# EAGLE design datalogger (EAGLE 9.2.2)
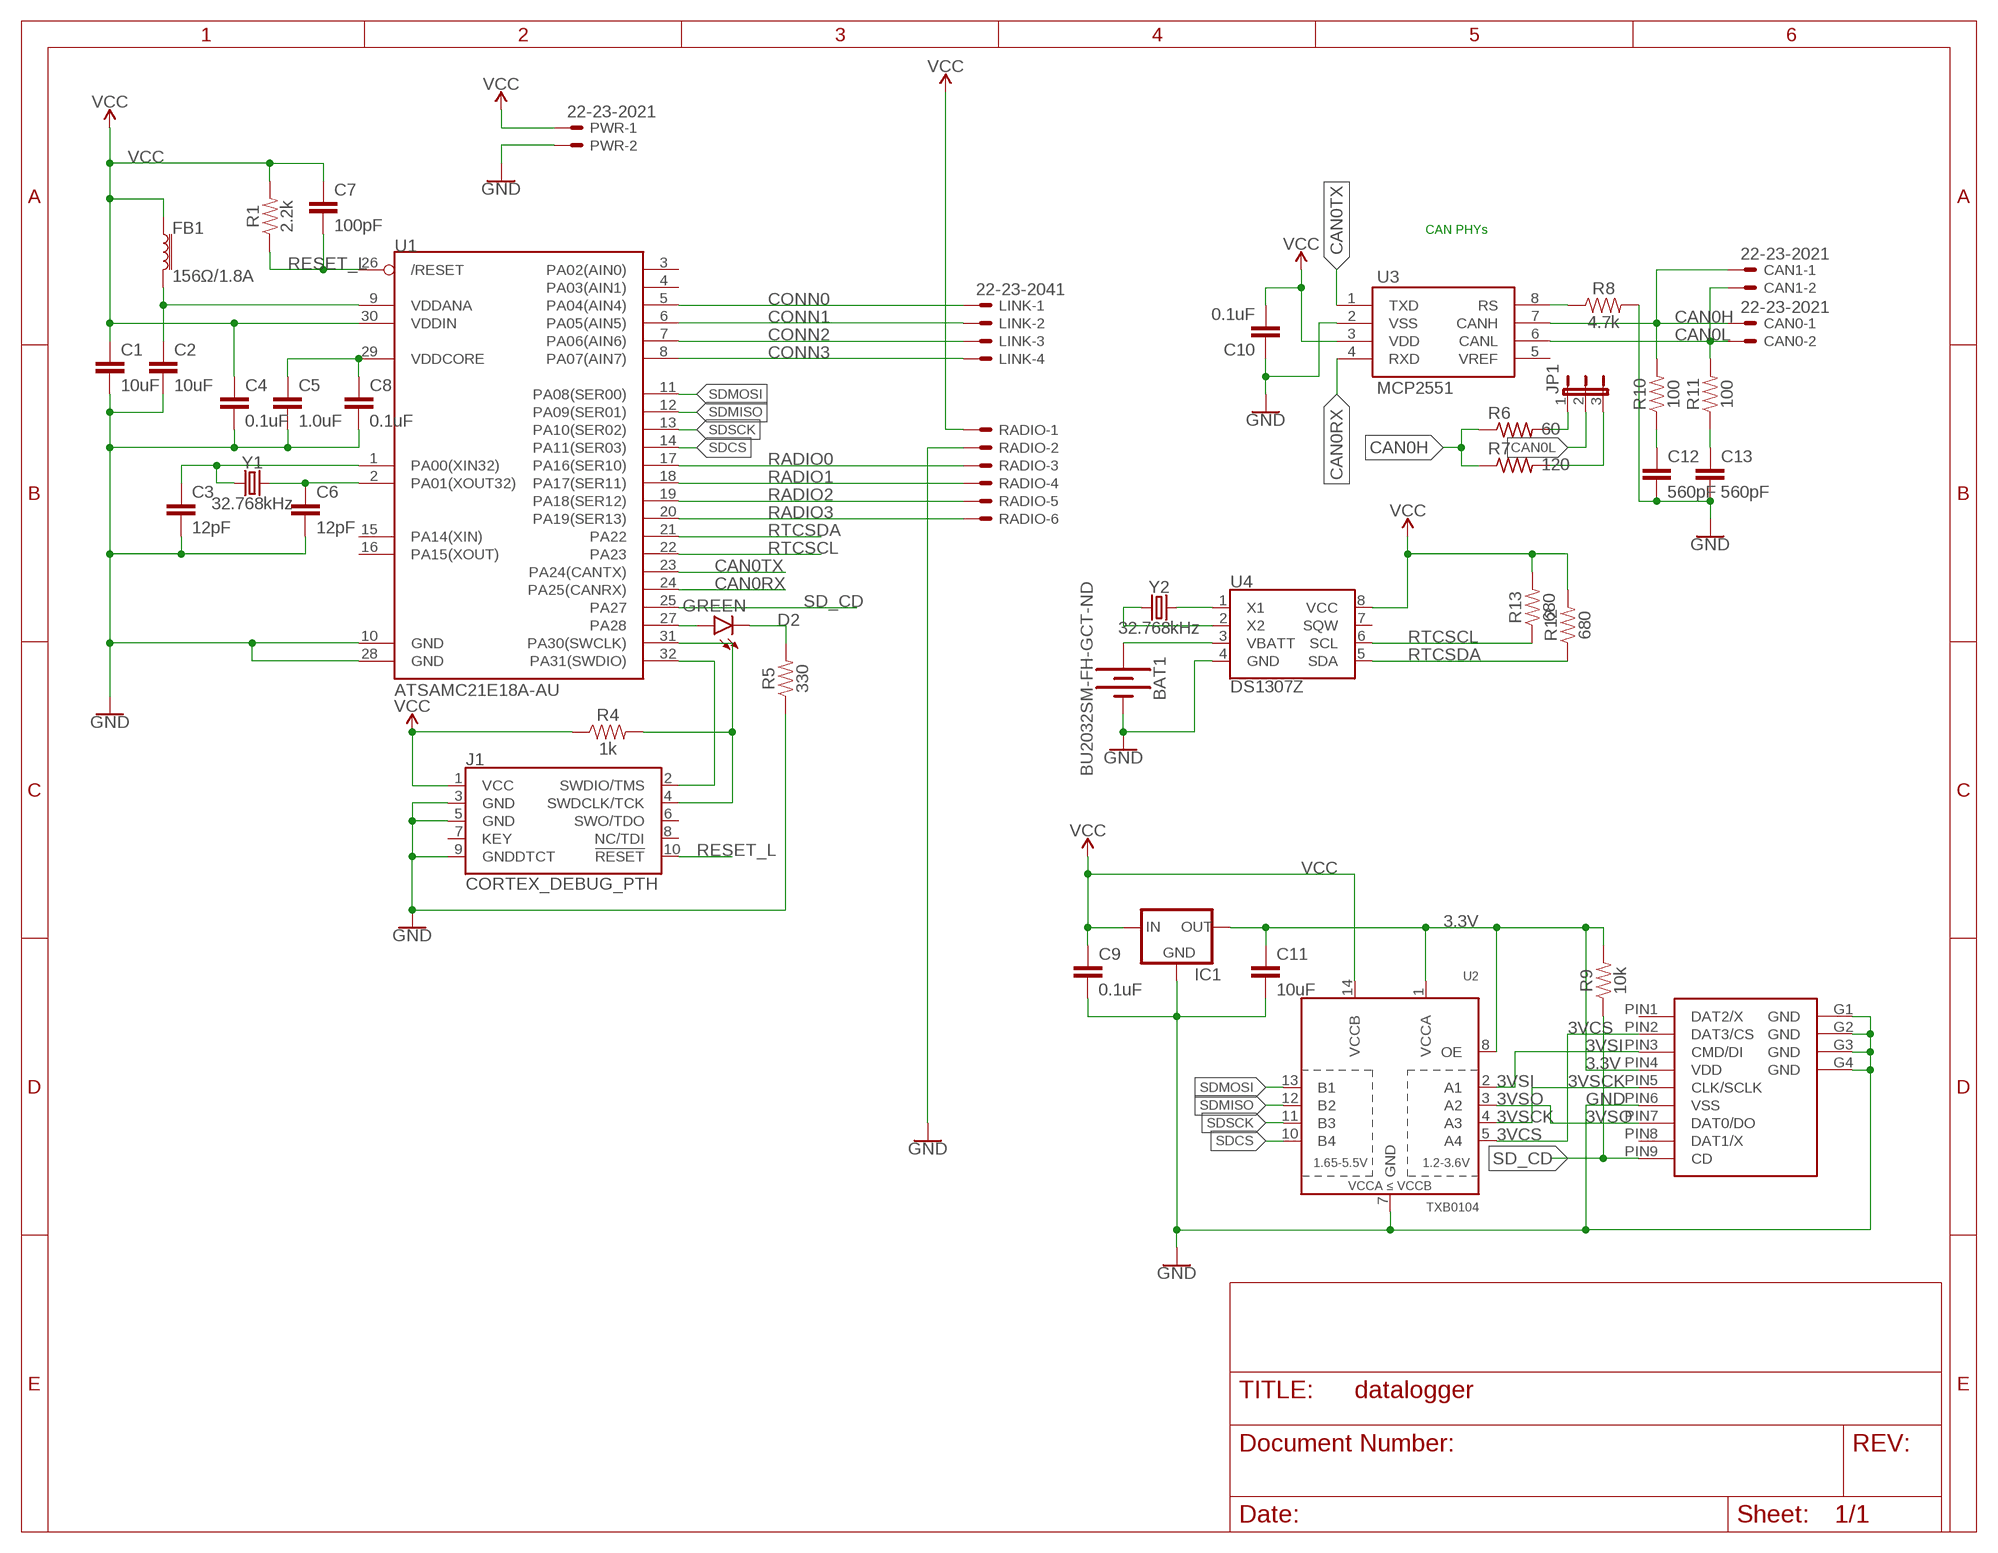
[diagram p0: schematic, sheet 1]

## Parts
BAT1  BU2032SM-FH-GCT-ND  [BAT_BU2032SM-BT-GTR]
C1  10uF  10UF-0603-6.3V-20%  [0603]
C2  10uF  10UF-0603-6.3V-20%  [0603]
C3  12pF  12PF-0603-50V-5%  [0603]
C4  0.1uF  0.1UF-0603-25V-(+80/-20%)  [0603]
C5  1.0uF  1.0UF-0603-16V-10%  [0603]
C6  12pF  12PF-0603-50V-5%  [0603]
C7  100pF  100PF-0603-50V-5%  [0603]
C8  0.1uF  0.1UF-0603-25V-(+80/-20%)  [0603]
C9  0.1uF  0.1UF-0603-25V-(+80/-20%)  [0603]
C10  0.1uF  0.1UF-0603-25V-(+80/-20%)  [0603]
C11  10uF  10UF-0603-6.3V-20%  [0603]
C12  560pF  560PF-0603-50V-5%  [0603]
C13  560pF  560PF-0603-50V-5%  [0603]
CAN0  22-23-2021  [22-23-2021]
CAN1  22-23-2021  [22-23-2021]
D2  GREEN  LED3MM  [LED_3MM]
FB1  156Ω/1.8A  FERRITE_BEAD-0603  [0603]
IC1  78LXX  [78LXX]
J1  CORTEX_DEBUG_PTH  [2X5-PTH-1.27MM]
JP1  JP2E  [JP2]
LINK  22-23-2041  [22-23-2041]
PWR  22-23-2021  [22-23-2021]
R1  2.2k  2.2KOHM-0603-1/10W-1%  [0603]
R4  1k  1KOHM-0603-1/10W-1%  [0603]
R5  330  330OHM-0603-1/10W-1%  [0603]
R6  60  R-US_R0603  [R0603]
R7  120  R-US_R0603  [R0603]
R8  4.7k  4.7KOHM-0603-1/10W-1%  [0603]
R9  10k  10KOHM-0603-1/10W-1%  [0603]
R10  100  100OHM-0603-1/4W-5%  [0603]
R11  100  100OHM-0603-1/4W-5%  [0603]
R12  680  680OHM-0603-1/10W-5%  [0603]
R13  680  680OHM-0603-1/10W-5%  [0603]
RADIO  22-23-2061  [22-23-2061]
SD1  WM14405CT-ND  [1051620001-SMD]
U1  ATSAMC21E18A-AU  [TQFP32-08]
U2  TXB0104  TXB0104PWR  [TSSOP14]
U3  MCP2551  [SO08]
U4  DS1307Z  [SO08-0.15]
Y1  32.768kHz  CRYSTAL-32.768KHZPTH-2X6  [CRYSTAL-PTH-2X6-CYL]
Y2  32.768kHz  CRYSTAL-32.768KHZPTH-2X6  [CRYSTAL-PTH-2X6-CYL]

## Nets
3.3V: C11.1 IC1.OUT R9.2 SD1.PIN4(VDD) U2.1(VCCA) U2.8(OE)
3VCS: SD1.PIN2(DAT3/CS) U2.5(A4)
3VSCK: SD1.PIN5(CLK/SCLK) U2.4(A3)
3VSI: SD1.PIN3(CMD/DI) U2.2(A1)
3VSO: SD1.PIN7(DAT0/DO) U2.3(A2)
C1HRC: C12.1 R10.1
C1LRC: C13.1 R11.1
C1RS: R8.1 U3.8(RS)
CAN0H: CAN0.1 CAN1.1 R6.1 R7.1 R10.2 U3.7(CANH)
CAN0L: CAN0.2 CAN1.2 JP1.2 R11.2 U3.6(CANL)
CAN0RX: U1.24(PA25(CANRX)) U3.4(RXD)
CAN0TX: U1.23(PA24(CANTX)) U3.1(TXD)
CONN0: LINK.1 U1.5(PA04(AIN4))
CONN1: LINK.2 U1.6(PA05(AIN5))
CONN2: LINK.3 U1.7(PA06(AIN6))
CONN3: LINK.4 U1.8(PA07(AIN7))
GND [power]: BAT1.2(-) C1.2 C2.2 C3.2 C4.2 C5.2 C6.2 C8.2 C9.2 C10.1 C11.2 C12.2 C13.2 IC1.GND J1.3(GND) J1.5(GND) J1.9(GNDDTCT) PWR.2 R5.1 R8.2 RADIO.2 SD1.G1(GND) SD1.G2(GND) SD1.G3(GND) SD1.G4(GND) SD1.PIN6(VSS) U1.10(GND) U1.28(GND) U2.7(GND) U3.2(VSS) U4.4(GND)
LEDA: D2.A U1.27(PA28)
LEDC: D2.K(C) R5.2
N$1: BAT1.1(+) U4.3(VBATT)
N$4: U4.1(X1) Y2.2
N$5: JP1.1 R6.2
N$6: U4.2(X2) Y2.1
N$7: JP1.3 R7.2
RADIO0: RADIO.3 U1.17(PA16(SER10))
RADIO1: RADIO.4 U1.18(PA17(SER11))
RADIO2: RADIO.5 U1.19(PA18(SER12))
RADIO3: RADIO.6 U1.20(PA19(SER13))
RESET_L: C7.2 J1.10(!RESET) R1.1 U1.26(/RESET)
RTCSCL: R13.1 U1.22(PA23) U4.6(SCL)
RTCSDA: R12.1 U1.21(PA22) U4.5(SDA)
SD_CD: R9.1 SD1.PIN9(CD) U1.25(PA27)
SDCS: U1.14(PA11(SER03)) U2.10(B4)
SDMISO: U1.12(PA09(SER01)) U2.12(B2)
SDMOSI: U1.11(PA08(SER00)) U2.13(B1)
SDSCK: U1.13(PA10(SER02)) U2.11(B3)
SWDCLK: J1.4(SWDCLK/TCK) R4.2 U1.31(PA30(SWCLK))
SWDIO: J1.2(SWDIO/TMS) U1.32(PA31(SWDIO))
VCC [power]: C1.1 C4.1 C7.1 C9.1 C10.2 FB1.1 IC1.IN J1.1(VCC) PWR.1 R1.2 R4.1 R12.2 R13.2 RADIO.1 U1.30(VDDIN) U2.14(VCCB) U3.3(VDD) U4.8(VCC)
VDDANA1: C2.1 FB1.2 U1.9(VDDANA)
VDDCORE: C5.1 C8.1 U1.29(VDDCORE)
XIN32: C3.1 U1.1(PA00(XIN32)) Y1.1
XOUT32: C6.1 U1.2(PA01(XOUT32)) Y1.2
Unconnected: J1.6(SWO/TDO) J1.7(KEY) J1.8(NC/TDI) SD1.PIN1(DAT2/X) SD1.PIN8(DAT1/X) U1.3(PA02(AIN0)) U1.4(PA03(AIN1)) U1.15(PA14(XIN)) U1.16(PA15(XOUT)) U3.5(VREF) U4.7(SQW)

## Notes on the sheet
- CAN PHYs

## Library data of the parts
BAT1 = washuracing:BU2032SM-FH-GCT-ND: CR2032 SM COIN CELL HOLDER
C1 C2 C11 = SparkFun-Capacitors:10UF: 10.0µF ceramic capacitors A capacitor is a passive two-terminal electrical component used to store electrical energy temporarily in an electric field.; PROD_ID: CAP-11015
C3 C6 = SparkFun-Capacitors:12PF: 12pF ceramic capacitors A capacitor is a passive two-terminal electrical component used to store electrical energy temporarily in an electric field.; PROD_ID: CAP-09137
C4 C8-C10 = SparkFun-Capacitors:0.1UF: 0.1µF ceramic capacitors A capacitor is a passive two-terminal electrical component used to store electrical energy temporarily in an electric field.; PROD_ID: CAP-00810
C5 = SparkFun-Capacitors:1.0UF: 1µF ceramic capacitors A capacitor is a passive two-terminal electrical component used to store electrical energy temporarily in an electric field.; PROD_ID: CAP-00868
C7 = SparkFun-Capacitors:100PF: 100pF/0.1nF ceramic capacitors A capacitor is a passive two-terminal electrical component used to store electrical energy temporarily in an electric field.; PROD_ID: CAP-07883
C12 C13 = SparkFun-Capacitors:560PF: 0.56nF/560pF ceramic capacitors A capacitor is a passive two-terminal electrical component used to store electrical energy temporarily in an electric field.; PROD_ID: CAP-08749
CAN0 CAN1 PWR = con-molex:22-23-2021: .100" (2.54mm) Center Header - 2 Pin; MF: MOLEX; MPN: 22-23-2021; OC_FARNELL: 1462926; OC_NEWARK: 25C3832
D2 = SparkFun-LED:LED: LED (Generic) Standard schematic elements and footprints for 5mm, 3mm, 1206, and 0603 sized LEDs. Generic LEDs with no color specified.; PROD_ID: DIO-08794
FB1 = SparkFun-Coils:FERRITE_BEAD: Ferrite Bead (blocks, cores, rings, chokes, etc.) Inductor with layers of ferrite used to suppress high frequencies. Often used to isolate high frequency noise. SparkFun Products: IOIO-OTG - V2.2 <https://www.sparkfun.com/products/13613> SparkFun SAMD21 Mini Breakout <https://www.sparkfun.com/products/13664> SparkFun 6 Degrees of Freedom Breakout - LSM6DS3 <https://www.sparkfun.com/products/13339> SparkFun SAMD21 Dev Breakout <https://www.sparkfun.com/products/13672>; PROD_ID: NDUC-07859; VALUE: 30Ω/1.8A
IC1 = v-reg:78LXX: VOLTAGE REGULATOR
J1 = SparkFun-Connectors:CORTEX_DEBUG: Cortex Debug Connector - 10 pin Supports JTAG debug, Serial Wire debug, and Serial Wire Viewer. PTH and SMD connector options available. General Connector Information <http://infocenter.arm.com/help/topic/com.arm.doc.faqs/attached/13634/cortex_debug_connectors.pdf> Products: PTH Connector <http://www.digikey.com/product-detail/en/cnc-tech/3220-10-0100-00/1175-1627-ND/3883661> -via Digi-Key SparkFun PSoc <https://www.sparkfun.com/products/13229> SparkFun T <https://www.sparkfun.com/products/13810>
JP1 = jumper:JP2E: JUMPER
LINK = con-molex:22-23-2041: .100" (2.54mm) Center Header - 4 Pin; MF: MOLEX; MPN: 22-23-2041; OC_FARNELL: 1462920; OC_NEWARK: 38C0355
R1 = SparkFun-Resistors:2.2KOHM: 2.2kΩ resistor A resistor is a passive two-terminal electrical component that implements electrical resistance as a circuit element. Resistors act to reduce current flow, and, at the same time, act to lower voltage levels within circuits. - Wikipedia; PROD_ID: RES-08272
R4 = SparkFun-Resistors:1KOHM: 1kΩ resistor A resistor is a passive two-terminal electrical component that implements electrical resistance as a circuit element. Resistors act to reduce current flow, and, at the same time, act to lower voltage levels within circuits. - Wikipedia; PROD_ID: RES-07856
R5 = SparkFun-Resistors:330OHM: 330Ω resistor A resistor is a passive two-terminal electrical component that implements electrical resistance as a circuit element. Resistors act to reduce current flow, and, at the same time, act to lower voltage levels within circuits. - Wikipedia; PROD_ID: RES-00818
R6 R7 = rcl:R-US_: RESISTOR, American symbol; SPICEPREFIX: R
R8 = SparkFun-Resistors:4.7KOHM: 4.7kΩ resistor A resistor is a passive two-terminal electrical component that implements electrical resistance as a circuit element. Resistors act to reduce current flow, and, at the same time, act to lower voltage levels within circuits. - Wikipedia; PROD_ID: RES-07857
R9 = SparkFun-Resistors:10KOHM: 10kΩ resistor A resistor is a passive two-terminal electrical component that implements electrical resistance as a circuit element. Resistors act to reduce current flow, and, at the same time, act to lower voltage levels within circuits. - Wikipedia; PROD_ID: RES-00824
R10 R11 = SparkFun-Resistors:100OHM: 100Ω resistor A resistor is a passive two-terminal electrical component that implements electrical resistance as a circuit element. Resistors act to reduce current flow, and, at the same time, act to lower voltage levels within circuits. - Wikipedia; PROD_ID: RES-12438
R12 R13 = SparkFun-Resistors:680OHM: 680Ω resistor A resistor is a passive two-terminal electrical component that implements electrical resistance as a circuit element. Resistors act to reduce current flow, and, at the same time, act to lower voltage levels within circuits. - Wikipedia; PROD_ID: RES-09333
RADIO = con-molex:22-23-2061: .100" (2.54mm) Center Header - 6 Pin; MF: MOLEX; MPN: 22-23-2061; OC_FARNELL: 1462922; OC_NEWARK: 27C1933
SD1 = washuracing:WM14405CT-ND: 1.45H MICRO SD HEADER WITH D/C P 9 (8 + 1) Position Card Connector microSD™ Surface Mount, Right Angle Gold
U1 = washuracing:ATSAMC21E18A: 5-Volt 32-Bit ARM Cortex M0+ MCU with CAN-FD
U2 = SparkFun-IC-Comms:TXB0104PWR: 4-Bit Bi-Directional Level Shifter 1.2V-3.6V (VCCA) to 1.65V-5.5V (VCCB) bi-directional level shifter with auto direction sensing. Max data rate - VCCA 1.8V: 20Mbps (50ns), VCCA 3.3V: 100Mbps (10ns) Digikey: 296-21929-1-ND (TSSOP) Datasheet <http://cdn.sparkfun.com/datasheets/BreakoutBoards/txb0104.pdf> SparkFun Products SparkFun Cellular Shield - MG2639 <https://www.sparkfun.com/products/13120> (CEL-13120) SparkFun Level Shifting microSD Breakout <https://www.sparkfun.com/products/13743> (DEV-13743) SparkFun Voltage-Level Translator Breakout - TXB0104 <https://www.sparkfun.com/products/11771> (BOB-11771) SparkFun Block for Intel® Edison - UART <https://www.sparkfun.com/products/13040> (DEV-13040) SparkFun Block for Intel® Edison - Arduino <https://www.sparkfun.com/products/13036> (DEV-13036); PROD_ID: NA-XXXXX
U3 = SparkFun-IC-Comms:MCP2551: MCP2551 High Speed CAN Transceiver High speed CAN transceiver Datasheet <http://www.sparkfun.com/datasheets/DevTools/Arduino/MCP2551.pdf> SparkFun Products CAN-BUS Shield <https://www.sparkfun.com/products/13262> (DEV-13262) SparkFun OBD-II UART <https://www.sparkfun.com/products/9555> (WIG-09555); PROD_ID: IC-09907
U4 = SparkFun-Clocks:DS1307: Maxim DS1307 - I2C Real-time clock (RTC) The DS1307 serial real-time clock (RTC) is a low-power, full binary-coded decimal (BCD) clock/calendar plus 56 bytes of NV SRAM. Address and data are transferred serially through an I2C, bidirectional bus. The clock/calendar provides seconds, minutes, hours, day, date, month, and year information. SparkFun Products: Real Time Clock Module <https://www.sparkfun.com/products/12708> (BOB-12708) Datasheet <https://cdn.sparkfun.com/datasheets/BreakoutBoards/DS1307.pdf>; PROD_ID: IC-08138
Y1 Y2 = SparkFun-Clocks:CRYSTAL-32.768KHZ: 32.768kHz Crystal Frequency: 32.768kHz Frequency Stability: ±20ppm Load Capacitance: 12.5pF (PTH-2X6 & SMD-3.2X1.5), 6pF (SMD-2X6) SparkFun Products: SparkFun BigTime Watch Kit <https://www.sparkfun.com/products/11734> SparkFun nRF52832 Breakout <https://www.sparkfun.com/products/13990> SparkFun Real Time Clock Module <https://www.sparkfun.com/products/12708>; PROD_ID: XTAL-10112

## Net classes
0 default: width 0.203 mm
1 power: width 0.406 mm

## Board
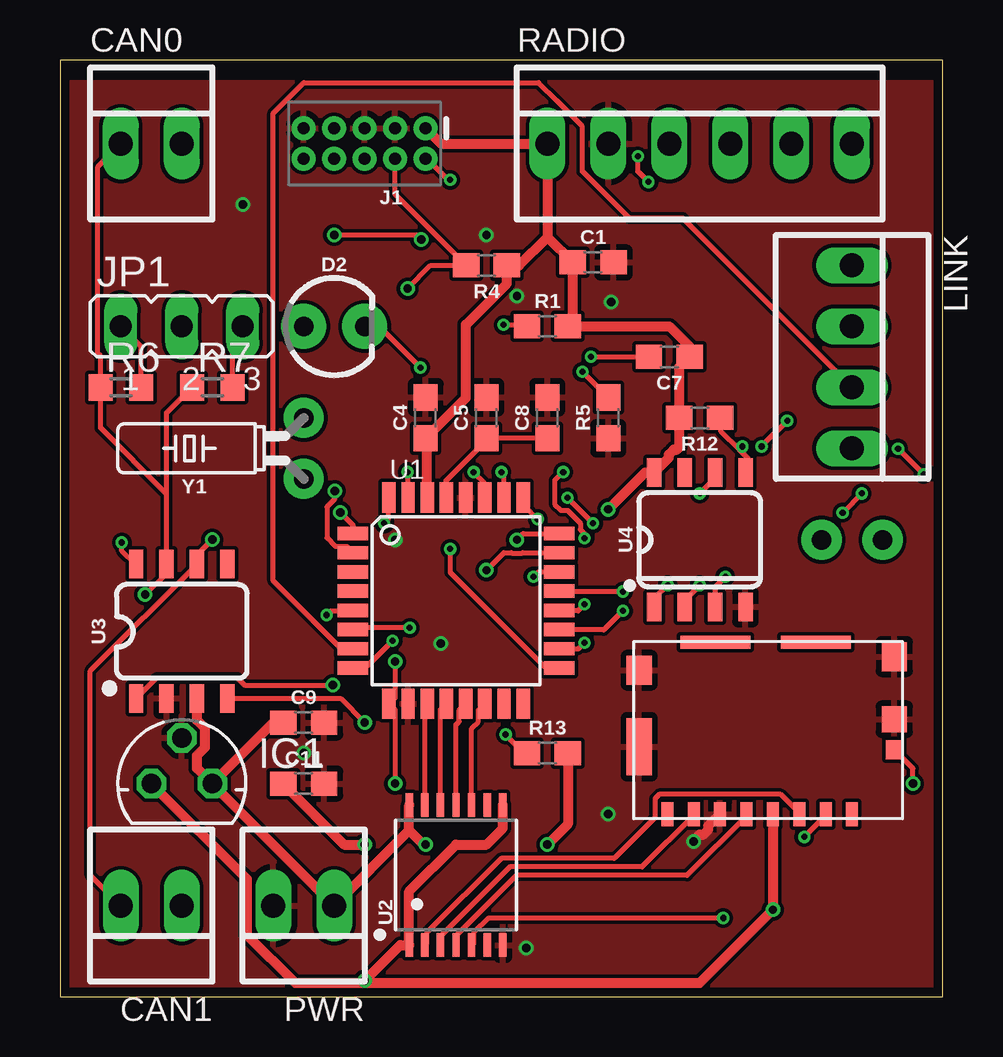
[diagram p1: board, top side]
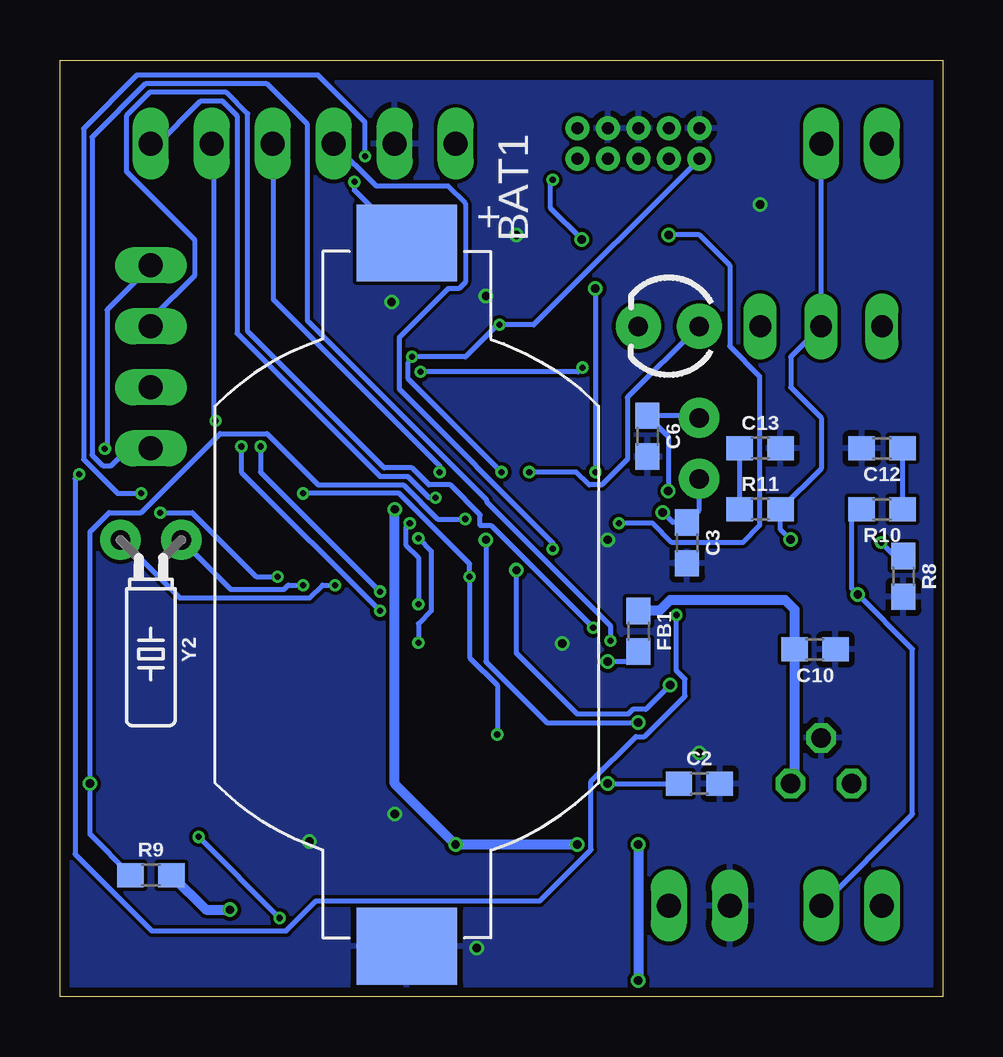
[diagram p2: board, bottom side, seen from below]

Size 36.81 x 39.04 mm. Coordinates in mm from the lower left corner, seen from the top.
Outline: 0,0 36.81,0 36.81,39.04 0,39.04 0,0
Copper layers (1*16): Top 0.035559375mm / dielectric 1.6mm / Bottom 0.035559375mm
Design rules "oshpark-2layer": minimum track width 6mil, minimum drill 10mil, track to track 6mil, track to pad 6mil, pad to pad 6mil, via to via 6mil, smd to smd 6mil, copper to edge 15mil, drill to drill 6mil, minimum pad ring 5mil, minimum via ring 5mil, stop-mask expansion 2.5mil, vias tented up to drill 0mil, thermal gap 10mil

### Footprints (pad centres in the part's own frame; a part is rotated, then mirrored left to right if it is on the bottom)
BAT_BU2032SM-BT-GTR = smd 3.2 x 4.2: 1 -14.65,0; 2 14.65,0
0603 = smd 1.1 x 1: 1 -0.85,0; 2 0.85,0
22-23-2021 = drill 1 long: 1 -1.27,0; 2 1.27,0
LED_3MM = drill 0.813 pad 1.88: A -1.27,0; K 1.27,0
78LXX = drill 0.813 octagon: GND 0,1.905; IN 1.27,0; OUT -1.27,0
2X5-PTH-1.27MM = drill 0.508 pad 1: 1 -2.54,-0.635; 2 -2.54,0.635; 3 -1.27,-0.635; 4 -1.27,0.635; 5 0,-0.635; 6 0,0.635; 7 1.27,-0.635; 8 1.27,0.635; 9 2.54,-0.635; 10 2.54,0.635
JP2 = drill 0.914 long: 1 -2.54,0; 2 0,0; 3 2.54,0
22-23-2041 = drill 1 long: 1 -3.81,0; 2 -1.27,0; 3 1.27,0; 4 3.81,0
R0603 = smd 1 x 1.1: 1 -0.85,0; 2 0.85,0
22-23-2061 = drill 1 long: 1 -6.35,0; 2 -3.81,0; 3 -1.27,0; 4 1.27,0; 5 3.81,0; 6 6.35,0
1051620001-SMD = smd 1.05 x 1.08: G1 1.76,3.95 | smd 1.05 x 1.2: G2 1.76,6.56; G3 -8.875,5.99 | smd 1.05 x 2.39: G4 -8.875,2.805 | smd 0.5 x 1: PIN1 0,0; PIN2 -1.1,0; PIN3 -2.2,0; PIN4 -3.3,0; PIN5 -4.4,0; PIN6 -5.5,0; PIN7 -6.6,0; PIN8 -7.7,0 | smd 0.72 x 0.78: PIN9 1.76,2.68 | smd 2.91 x 0.55: TL -5.695,7.16; TR -1.505,7.16
TQFP32-08 = smd 1.27 x 0.559: 1 -4.293,2.8; 2 -4.293,2; 3 -4.293,1.2; 4 -4.293,0.4; 5 -4.293,-0.4; 6 -4.293,-1.2; 7 -4.293,-2; 8 -4.293,-2.8; 17 4.293,-2.8; 18 4.293,-2; 19 4.293,-1.2; 20 4.293,-0.4; 21 4.293,0.4; 22 4.293,1.2; 23 4.293,2; 24 4.293,2.8 | smd 0.559 x 1.27: 9 -2.8,-4.293; 10 -2,-4.293; 11 -1.2,-4.293; 12 -0.4,-4.293; 13 0.4,-4.293; 14 1.2,-4.293; 15 2,-4.293; 16 2.8,-4.293; 25 2.8,4.293; 26 2,4.293; 27 1.2,4.293; 28 0.4,4.293; 29 -0.4,4.293; 30 -1.2,4.293; 31 -2,4.293; 32 -2.8,4.293
TSSOP14 = smd 0.305 x 0.991: 1 -1.95,-2.918; 2 -1.3,-2.918; 3 -0.65,-2.918; 4 0,-2.918; 5 0.65,-2.918; 6 1.3,-2.918; 7 1.95,-2.918; 8 1.95,2.918; 9 1.3,2.918; 10 0.65,2.918; 11 0,2.918; 12 -0.65,2.918; 13 -1.3,2.918; 14 -1.95,2.918
SO08 = smd 0.6 x 1.2: 1 -1.905,-2.8; 2 -0.635,-2.8; 3 0.635,-2.8; 4 1.905,-2.8; 5 1.905,2.8; 6 0.635,2.8; 7 -0.635,2.8; 8 -1.905,2.8
SO08-0.15 = smd 0.6 x 1.2: 1 -1.905,-2.8; 2 -0.635,-2.8; 3 0.635,-2.8; 4 1.905,-2.8; 5 1.905,2.8; 6 0.635,2.8; 7 -0.635,2.8; 8 -1.905,2.8
CRYSTAL-PTH-2X6-CYL = drill 0.813 pad 1.676: 1 -1.27,0; 2 1.27,0

### Placement (x,y rotation side)
BAT1  22.35,16.76 270 bottom
C1  22.23,30.61 0 top
C2  10.16,8.89 0 bottom
C3  10.67,18.92 270 bottom
C4  15.24,24.13 90 top
C5  17.78,24.13 90 top
C6  12.32,23.37 270 bottom
C7  25.4,26.67 180 top
C8  20.32,24.13 90 top
C9  10.16,11.43 0 top
C10  5.33,14.48 180 bottom
C11  10.16,8.89 0 top
C12  2.54,22.86 180 bottom
C13  7.62,22.86 0 bottom
CAN0  3.81,35.56 0 top
CAN1  3.81,3.81 180 top
D2  11.43,27.94 0 top
FB1  12.7,15.24 270 bottom
IC1  5.08,8.89 0 top
J1  12.7,35.56 180 top
JP1  5.08,27.94 0 top
LINK  33.02,26.67 270 top
PWR  10.16,3.81 180 top
R1  20.32,27.94 0 top
R4  17.78,30.48 180 top
R5  22.86,24.13 90 top
R6  2.54,25.4 0 top
R7  6.35,25.4 0 top
R8  1.65,17.53 270 bottom
R9  33.02,5.08 0 bottom
R10  2.54,20.32 180 bottom
R11  7.62,20.32 0 bottom
R12  26.67,24.13 180 top
R13  20.32,10.16 0 top
RADIO  26.67,35.56 0 top
SD1  33.02,7.62 0 top
U1  16.51,16.51 0 top
U2  16.51,5.08 0 top
U3  5.08,15.24 0 top
U4  26.67,19.05 0 top
Y1  10.16,22.86 90 top
Y2  33.02,19.05 180 bottom

### Tracks (layer width: path | path; a pad name or v marks a point on that pad's centre or on a via)
3.3V  (via drill 0.35)
  Top 0.406: IC1.OUT 7.78,4.92 7.78,2.6 9.8,0.58 12.7,0.58 | 12.7,0.58 26.67,0.58 v29.72,3.63 SD1.PIN4 | C11.1 11.85,6.35 v12.7,6.35 | 12.7,0.58 v12.7,0.68 14.18,2.16 U2.1 14.56,4.4 16.51,6.35 17.78,6.35 18.46,7.03 U2.8
  Bottom 0.406: v12.7,6.35 v12.7,0.68 | R9.2 30.72,3.63 v29.72,3.63
3VCS  (via drill 0.25)
  Top 0.203: v27.65,3.29 17.87,3.29 17.25,2.67 17.25,2.22 U2.5 | v31.03,6.67 31.91,7.56 SD1.PIN2
  Bottom 0.203: v31.03,6.67 v27.65,3.29
3VSCK
  Top 0.203: U2.4 16.54,2.22 16.54,2.58 19.02,5.07 26.14,5.07 28.63,7.56 SD1.PIN5
3VSI
  Top 0.203: U2.2 15.29,2.22 15.29,2.67 18.4,5.78 23.11,5.78 24.8,7.47 24.8,8.27 24.98,8.45 30.05,8.45 30.85,7.64 SD1.PIN3
3VSO
  Top 0.203: U2.3 15.91,2.22 15.91,2.58 18.76,5.42 24.27,5.42 26.4,7.56 SD1.PIN7
C1HRC
  Bottom 0.203: C12.1 R10.1
C1LRC
  Bottom 0.203: R11.1 C13.1
C1RS  (via drill 0.25)
  Top 0.203: v2.58,18.94 2.58,18.58 3.11,18.05 U3.8
  Bottom 0.203: v2.58,18.94 2.04,18.4 1.69,18.4 R8.1
CAN0H  (via drill 0.35)
  Top 0.203: v3.55,16.77 4.45,17.66 U3.7 4.45,20.95 | 4.45,20.95 1.69,23.71 R6.1 1.69,26.71 1.57,26.83 1.57,34.59 CAN0.1 | 4.45,20.95 4.45,24.34 R7.1
  Bottom 0.203: R10.2 3.81,19.9 3.81,17.03 v3.55,16.77 1.27,14.49 1.27,7.62 CAN1.1
CAN0L  (via drill 0.35)
  Top 0.203: v6.35,19.05 5.71,18.42 U3.6 1.27,13.6 1.27,5.08 CAN1.2
  Bottom 0.203: v6.35,19.05 6.77,19.48 R11.2 5.08,22.01 5.08,24.13 6.35,25.4 6.35,26.67 JP1.2 CAN0.2
CAN0RX  (via drill 0.35)
  Top 0.203: U3.4 11.69,12.44 v12.7,11.43 | v19.05,19.05 19.31,19.31 U1.24
  Bottom 0.203: v12.7,11.43 16.51,11.43 19.05,13.97 v19.05,19.05
CAN0TX  (via drill 0.35)
  Top 0.203: U3.1 3.19,12.44 4.04,13.29 7.39,13.29 7.69,13 v11.37,13 | v17.78,17.78 18.51,18.51 18.8,18.51 18.82,18.49 19.28,18.49 19.3,18.51 U1.23
  Bottom 0.203: v11.37,13 12.38,11.99 12.93,11.99 13.13,11.79 15.24,11.79 17.78,14.33 v17.78,17.78
CONN0  (via drill 0.25)
  Top 0.203: v11.11,15.91 11.29,16.09 12.18,16.09 U1.5 | v34.94,22.85 v36.01,21.78
  Bottom 0.203: v11.11,15.91 11.11,13.6 10.76,13.25 10.76,12.54 12.45,10.85 12.8,10.85 14.67,8.98 14.67,6.13 16.8,4 26.14,4 27.38,2.76 32.98,2.76 36.18,5.96 36.18,21.6 v36.01,21.78 | LINK.1 33.07,30.4 34.85,28.63 34.85,22.85 v34.94,22.85
CONN1  (via drill 0.25)
  Top 0.203: v14.58,15.38 12.27,15.38 U1.6
  Bottom 0.203: v14.58,15.38 18.85,19.65 19.29,19.65 19.29,20.09 20.54,21.34 21.43,21.34 22.14,22.05 23.29,22.05 28.98,27.74 28.98,36.8 29.87,37.69 33.07,37.69 34.05,36.72 34.05,34.4 31.2,31.56 31.2,30.05 32.98,28.27 32.98,28 LINK.2
CONN2
  Top 0.203: U1.7 12.18,14.58 11.65,14.58 8.89,17.34 8.89,36.83 10.16,38.1 19.95,38.1 20.71,37.34 20.77,37.28 21.78,36.27 21.78,34.4 23.74,32.45 25.96,32.45 32.98,25.43 LINK.3
CONN3  (via drill 0.25)
  Top 0.203: v13.87,14.85 12.8,13.78 12.27,13.78 U1.8
  Bottom 0.203: v13.87,14.85 13.87,15.47 19.02,20.62 19.02,20.71 26.49,28.18 26.49,36.36 28.18,38.05 33.25,38.05 35.47,35.83 35.47,22.58 35.03,22.14 34.67,22.14 34.12,22.69 33.96,22.85 33.95,22.86 LINK.4
GND  (via drill 0.35)
  Top 0.406: C9.2 11.02,11.47 11.11,11.47 | v26.42,6.48 26.42,6.52 26.66,6.76 26.82,6.76 27.03,6.97 27.03,7.13 SD1.PIN6
  other vias: 10.16,10.16 22.99,28.96 19.05,29.21 15.88,14.73 19.43,2.03 13.97,19.05 17.78,31.75 22.86,7.62 7.62,33.02
  pour Top: 0,0 36.83,0 36.83,38.1 0,38.1
  pour Bottom: 0,0 0,38.1 36.83,38.1 36.83,0
LEDA  (via drill 0.25)
  Top 0.203: v17.25,21.87 17.69,21.43 17.69,20.8 U1.27
  Bottom 0.203: v17.25,21.87 15.29,21.87 14.76,21.34 14.22,21.34 13.16,22.4 13.16,24.98 10.22,27.91 D2.A
LEDC  (via drill 0.25)
  Top 0.203: v21.78,26.05 22.85,24.98 R5.2 | v15.02,26.23 13.34,27.91 12.71,27.91 D2.K
  Bottom 0.203: v21.78,26.05 15.2,26.05 v15.02,26.23
N$1  (via drill 0.25)
  Top 0.203: v27.74,17.51 27.29,17.07 27.29,16.27 U4.3 | v33.43,20.98 v32.63,20.18 | v24.09,35.03 24.09,34.4 v24.54,33.96
  Bottom 0.203: v27.74,17.51 28.63,17.51 31.29,20.18 v32.63,20.18 | v33.43,20.98 34.4,20.98 35.83,22.4 35.83,36.18 33.6,38.41 26.05,38.41 24.09,36.45 v24.09,35.03 | v24.54,33.96 24.54,33.6 22.4,31.47 BAT1.1
N$4  (via drill 0.25)
  Top 0.203: v25.34,17.16 24.8,16.62 24.8,16.27 U4.1
  Bottom 0.203: v25.34,17.16 25.87,17.16 26.4,16.62 31.83,16.62 34.23,19.02 Y2.2
N$5
  Top 0.203: R6.2 3.39,27.09 JP1.1
N$6  (via drill 0.25)
  Top 0.203: v26.67,17.16 26.05,16.54 26.05,16.27 U4.2
  Bottom 0.203: v26.67,17.16 27.29,17.16 27.47,16.98 29.69,16.98 31.74,19.02 Y2.1
N$7
  Top 0.203: R7.2 7.2,27.52 JP1.3
RADIO0  (via drill 0.25)
  Top 0.203: v16.27,18.67 16.27,17.69 20.18,13.78 20.8,13.78 U1.17
  Bottom 0.203: v16.27,18.67 16.27,18.94 22.67,25.34 22.67,27.47 20.62,29.52 20.18,29.52 19.91,29.78 19.91,33.07 20.62,33.78 23.62,33.78 RADIO.3
RADIO1  (via drill 0.25)
  Top 0.203: v21.87,14.76 21.6,14.49 20.89,14.49 U1.18 | v21.87,19.11 21.87,19.29 21.69,19.47 21.69,19.74 21.16,20.27 20.89,20.27 20.62,20.54 20.62,21.51 v20.98,21.87
  Bottom 0.203: v21.87,14.76 21.87,15.56 21.34,16.09 21.34,18.58 v21.87,19.11 | v20.98,21.87 20.98,22.14 27.91,29.07 27.91,35.56 RADIO.4
RADIO2  (via drill 0.25)
  Top 0.203: v23.47,16.09 22.67,15.29 20.89,15.29 U1.19 | v30.32,24 v29.25,22.94
  Bottom 0.203: RADIO.5 30.4,35.48 30.4,24 v30.32,24 | v23.47,16.09 29.25,21.87 v29.25,22.94
RADIO3  (via drill 0.25)
  Top 0.203: v21.87,16.36 21.6,16.09 20.89,16.09 U1.20 | v21.16,20.8 v22.23,19.74
  Bottom 0.203: v21.87,16.36 21.87,18.31 22.4,18.85 22.4,19.56 v22.23,19.74 | v21.16,20.8 21.43,20.8 22.31,21.69 23.47,21.69 29.43,27.65 29.43,36.72 30.05,37.34 30.94,37.34 32.8,35.47 RADIO.6
RESET_L  (via drill 0.25)
  Top 0.203: v18.49,28 19.47,28 R1.1 | v22.14,26.67 C7.2 | v18.4,21.87 18.49,21.78 18.49,20.8 U1.26
  Bottom 0.203: J1.10 10.22,34.85 17.07,28 v18.49,28 18.58,28 19.91,26.67 v22.14,26.67 22.14,26.58 22.31,26.4 22.31,25.78 v18.4,21.87
RTCSCL  (via drill 0.25)
  Top 0.203: v18.58,10.94 19.29,10.22 19.47,10.22 R13.1 | v19.74,17.51 19.91,17.69 20.8,17.69 U1.22 | v26.67,20.98 27.29,21.6 27.29,21.78 U4.6
  Bottom 0.203: v18.58,10.94 18.58,12.98 19.74,14.13 v19.74,17.51 19.74,18.05 22.67,20.98 v26.67,20.98
RTCSDA  (via drill 0.25)
  Top 0.203: 28.32,22.8 28.71,22.4 28.71,21.96 28.63,21.87 U4.5 | 28.32,22.8 27.56,23.56 27.56,24.09 R12.1 | v23.47,16.89 20.8,16.89 U1.21 | 28.32,22.8 v28.45,22.94
  Bottom 0.203: v23.47,16.89 28.45,21.87 v28.45,22.94
SD_CD  (via drill 0.25, 0.35)
  Top 0.203: v35.56,8.89 35.56,9.52 SD1.PIN9 | v19.91,19.91 19.38,20.45 19.38,20.8 U1.25
  Bottom 0.203: R9.1 35.56,6.77 v35.56,8.89 35.56,19.38 34.76,20.18 33.43,20.18 30.14,23.47 28.18,23.47 26.05,21.34 22.49,21.34 21.07,19.91 v19.91,19.91
SDCS
  Top 0.203: U1.14 17.44,11.95 17.44,11.48 17.16,11.19 U2.10
SDMISO
  Top 0.203: U2.12 15.86,11.97 U1.12
SDMOSI
  Top 0.203: U2.13 15.21,12.12 U1.11
SDSCK
  Top 0.203: U2.11 16.51,11.34 16.64,11.48 16.64,11.95 U1.13
SWDCLK  (via drill 0.25, 0.35)
  Top 0.203: J1.4 13.97,33.44 R4.2 15.46,30.48 v14.49,29.52 | v14.49,21.87 14.49,20.8 U1.31
  Bottom 0.203: v14.49,29.52 v14.49,21.87
SWDIO  (via drill 0.25, 0.35)
  Top 0.203: v13.51,19.74 13.69,19.91 13.69,20.8 U1.32 | v16.27,34.05 16.18,34.14 16.09,34.14 15.29,34.94 J1.2 | v11.43,31.75 14.87,31.75 v15.06,31.57
  Bottom 0.203: v13.51,19.74 12.09,19.74 11.29,18.94 8.36,18.94 7.64,19.65 7.64,25.87 8.89,27.11 8.89,30.48 10.16,31.75 v11.43,31.75 | v16.27,34.05 16.36,34.14 16.36,32.87 v15.06,31.57
VCC  (via drill 0.35)
  Top 0.406: 14.56,6.94 PWR.1 IC1.IN | 14.56,6.94 U2.14 | J1.1 15.88,35.56 RADIO.1 20.32,31.66 | 14.56,6.94 15.15,6.35 v15.24,6.35 | U1.30 15.31,23.21 C4.1 16.92,24.96 16.92,28.01 18.63,29.72 R4.1 19.14,30.48 20.32,31.66 | 20.32,31.66 C1.1 21.38,28.14 R1.2 25.4,27.94 26.25,27.09 C7.1 25.82,26.24 R12.2 25.82,22.91 25.72,22.81 25.59,22.81 25.38,22.6 25.38,22.46 U4.8 24.39,21.85 v22.86,20.32 | R13.2 21.17,7.2 v20.32,6.35 | IC1.IN 5.71,9.53 5.71,10.06 6.04,10.39 6.04,11.2 5.71,11.53 U3.3 | IC1.IN 8.89,11.43 C9.1
  Bottom 0.406: v15.24,6.35 v20.32,6.35 22.86,8.89 v22.86,20.32 | FB1.1 12.62,16.09 11.82,16.09 11.38,16.54 6.58,16.54 6.18,16.14 C10.2 6.18,9.06 IC1.IN
VDDANA1  (via drill 0.35)
  Top 0.203: v13.97,13.97 13.97,12.48 U1.9 13.97,11.96 v13.97,8.89
  Bottom 0.203: FB1.2 13.12,13.97 v13.97,13.97 | v13.97,8.89 C2.1
VDDCORE
  Top 0.203: U1.29 16.09,20.8 16.09,21.51 17.78,23.2 C5.1 17.87,23.29 20.27,23.29 C8.1
XIN32  (via drill 0.35)
  Top 0.203: v11.68,20.19 12.22,19.66 U1.1
  Bottom 0.203: Y1.1 10.16,20.28 C3.1 11.26,19.77 v11.68,20.19
XOUT32  (via drill 0.35)
  Top 0.203: v11.45,21.08 11.45,20.75 11.13,20.42 11.13,19.13 11.48,18.78 11.95,18.78 U1.2
  Bottom 0.203: Y1.2 10.25,24.22 C6.1 11.45,23.35 v11.45,21.08